# EAGLE design jlink_to_tag (EAGLE 9.6.2)
AUTHOR: Joshua Adkins; REV: E; TITLE: JLink to Tag Connect
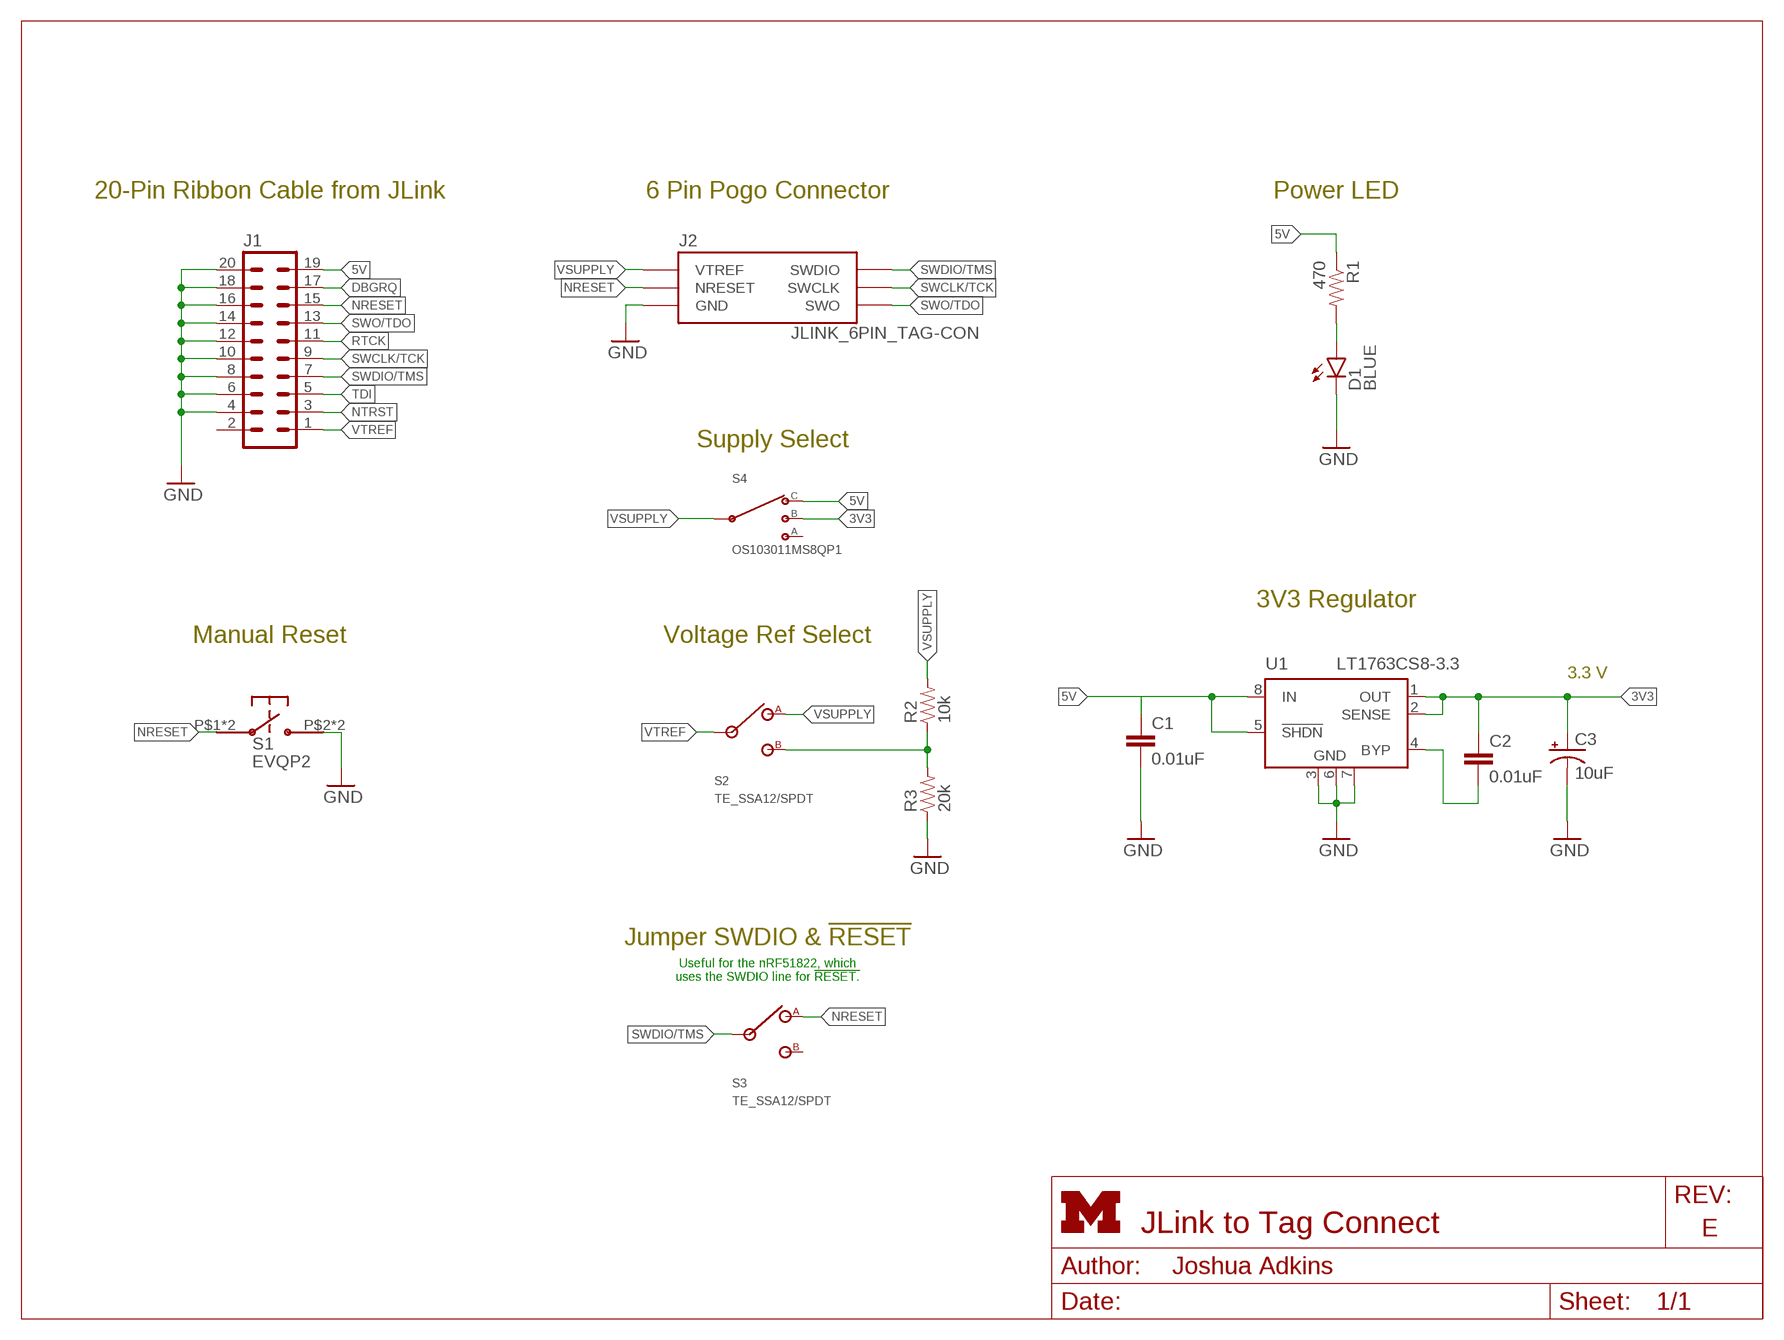
[diagram p0: schematic, sheet 1]
FRAME1 (LETTER_L): HEIGHT: 8.5in; WIDTH: 11in

## Parts
C1  0.01uF  C-EUC0603  [C0603]
C2  0.01uF  C-EUC0603  [C0603]
C3  10uF  CAP_POL1206  [EIA3216]
D1  BLUE  LED-BLUE0603  [LED-0603]
J1  ML20  [ML20]
J2  JLINK_6PIN_TAG-CON  [2X3_MALE_SHROUDED_0.100]
R1  470  RESISTOR0603-RES  [0603-RES]
R2  10k  RESISTOR0603_RES  [0603-RES]
R3  20k  RESISTOR0603_RES  [0603-RES]
S1  EVQP2  [EVQP2]
S2  TE_SSA12/SPDT  [TE_SSA12/SPDT]
S3  TE_SSA12/SPDT  [TE_SSA12/SPDT]
S4  OS103011MS8QP1  [OS102011MS8QP1]
U1  LT1763CS8-3.3  [SOIC8]

## Nets
3V3: C2.1 C3.A(+) S4.3 U1.1(OUT) U1.2(SENSE)
5V: C1.1 J1.19 R1.1 S4.4 U1.5(!SHDN) U1.8(IN)
DBGRQ: J1.17
GND: C1.2 C3.C(-) D1.C J1.4 J1.6 J1.8 J1.10 J1.12 J1.14 J1.16 J1.18 J1.20 J2.5(GND) R3.1 S1.P$2 S1.P$4 U1.3(GND) U1.6(GND) U1.7(GND)
N$1: R2.1 R3.2 S2.2(B)
N$3: D1.A R1.2
N$4: C2.2 U1.4(BYP)
NRESET: J1.15 J2.3(NRESET) S1.P$1 S1.P$3 S3.1(A)
NTRST: J1.3
RTCK: J1.11
SWCLK/TCK: J1.9 J2.4(SWCLK)
SWDIO/TMS: J1.7 J2.2(SWDIO) S3.IN
SWO/TDO: J1.13 J2.6(SWO)
TDI: J1.5
VSUPPLY: J2.1(VTREF) R2.2 S2.1(A) S4.2(C)
VTREF: J1.1 S2.IN
Unconnected: J1.2 S3.2(B) S4.1

## Notes on the sheet
- 20-Pin Ribbon Cable from JLink | 6 Pin Pogo Connector | Power LED
- Supply Select
- 3V3 Regulator
- Manual Reset | Voltage Ref Select
- 3.3 V
- Jumper SWDIO & !RESET
- Useful for the nRF51822, which
  uses the SWDIO line for !RESET.

## Library data of the parts
C1 C2 = resistor:C-EU: CAPACITOR, European symbol; DIGIKEY: 490-1512-1-ND
C3 = SparkFun-Passives:CAP_POL: Capacitor Polarized These are standard SMD and PTH capacitors. Normally 10uF, 47uF, and 100uF in electrolytic and tantalum varieties. Always verify the external diameter of the through hole cap, it varies with capacity, voltage, and manufacturer. The EIA devices should be standard.; DIGIKEY: 399-3684-1-ND
D1 = SparkFun-LED:LED-BLUE: Blue LEDs for production use Various blue LEDs stocked by SparkFun production 0603 - DIO-08575 Rebel - DIO-09553 1206 - DIO-09911; DIGIKEY: 160-1827-1-ND; PROD_ID: DIO-08575
J1 = con-ml:ML20: HARTING; DIGIKEY: S9172-ND; OC_FARNELL: unknown; OC_NEWARK: unknown
J2 = headers:JLINK_6PIN_TAG-CON: This is a 6-pin Tag Connect header with the J-Link.; DIGIKEY: 3M15451-ND
R1 = SparkFun-Passives:RESISTOR: Resistor; DIGIKEY: P470DBCT-ND
R2 = passives:RESISTOR: Resistor; DIGIKEY: RMCF0603FT10K0CT-ND
R3 = passives:RESISTOR: Resistor; DIGIKEY: P20.0KHCT-ND
S1 = switches:EVQP2: SWITCH TACTILE SPST-NO 0.02A 15V; DIGIKEY: P11084SCT-ND
S2 S3 = switches:TE_SSA12/SPDT: SWITCH SLIDE SPDT 2POS SSA SER; DIGIKEY: 2223-SLW-883935-2A-D-ND; MPN: SLW-883935-2A-D
S4 = switches:OS103011MS8QP1: Slide Switch SP3T Through Hole; DIGIKEY: CKN9543-ND
U1 = linear-technology:LT1763CS8: 500mA, Low Noise, LDO Micropower Regulators Source: http://cds.linear.com/docs/Datasheet/1763ff.pdf; DIGIKEY: LT1763CS8-3.3#TRPBFCT-ND; MPN: LT1763CS8-3.3; OC_FARNELL: 1273617; OC_NEWARK: 57M6055

## Board
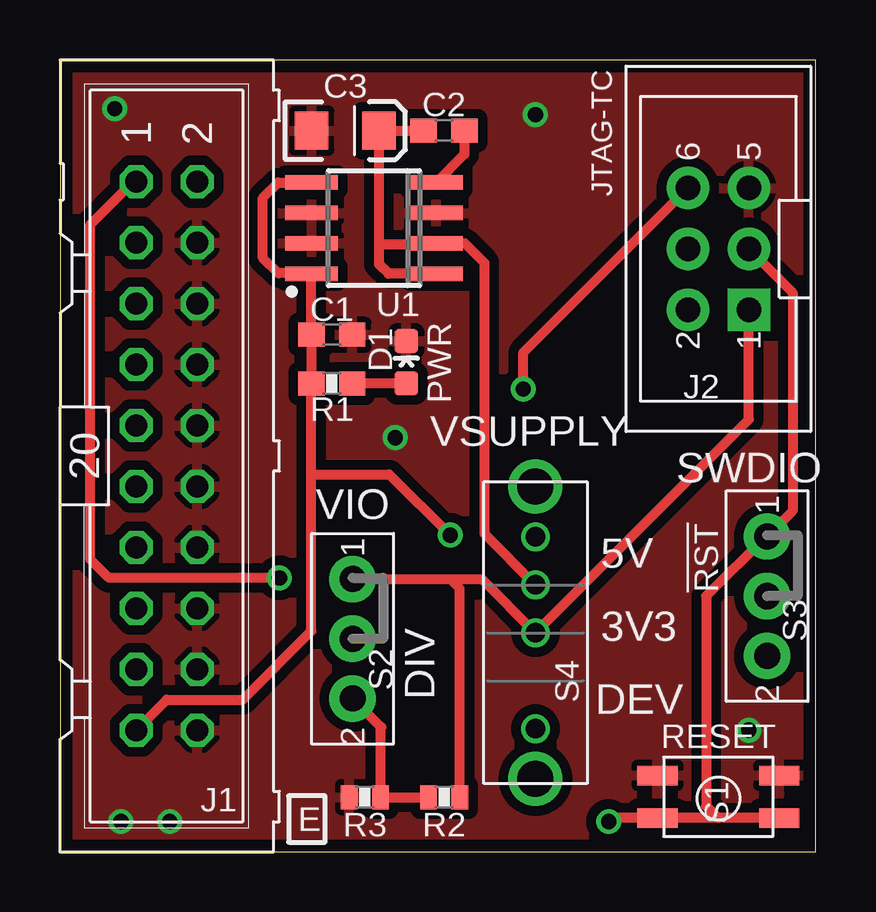
[diagram p1: board, top side]
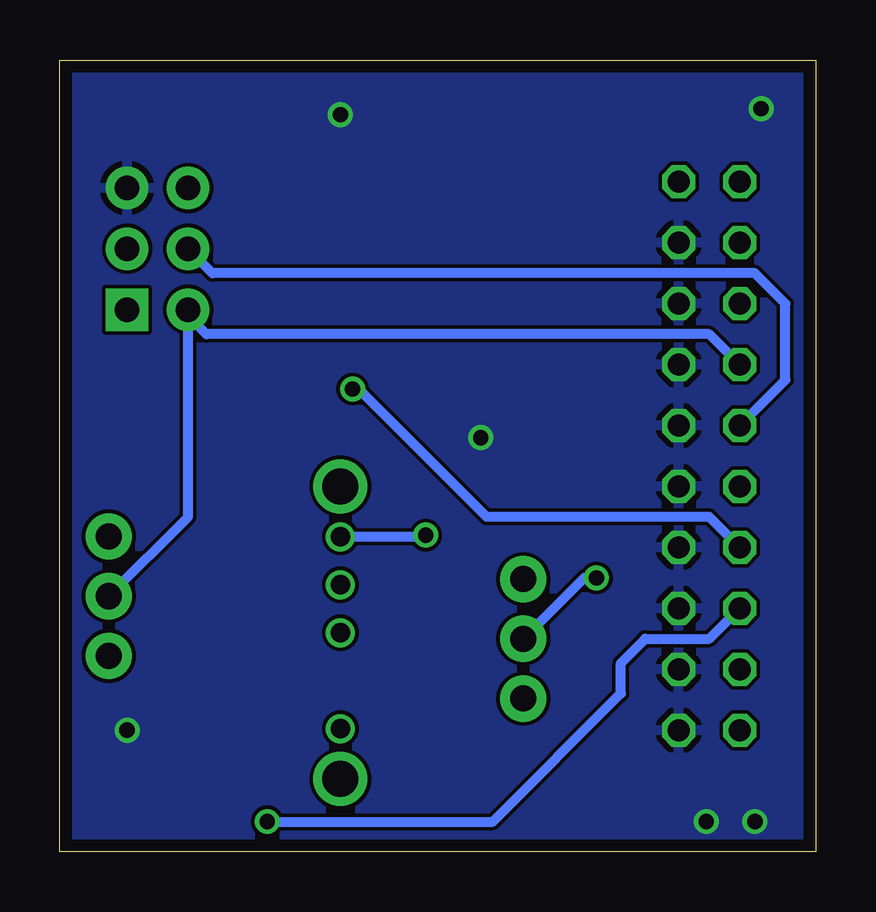
[diagram p2: board, bottom side, seen from below]

Size 31.5 x 33.02 mm. Coordinates in mm from the lower left corner, seen from the top.
Outline: 0,33.02 0,0 31.5,0 31.5,33.02 0,33.02
Copper layers (1*16): Top 0.0178mm / dielectric 59mil / Bottom 0.0178mm
Design rules "sunstone-2lyr_v1.0.0.3 *": minimum track width 6mil, minimum drill 14mil, track to track 6mil, track to pad 6mil, pad to pad 6mil, via to via 6mil, smd to smd 6mil, copper to edge 20mil, drill to drill 16mil, minimum pad ring 8mil, minimum via ring 8mil, stop-mask expansion 3mil, vias tented up to drill 50mil, thermal gap 10mil

### Footprints (pad centres in the part's own frame; a part is rotated, then mirrored left to right if it is on the bottom)
C0603 = smd 1.1 x 1: 1 -0.85,0; 2 0.85,0
EIA3216 = smd 1.4 x 1.6: A 1.4,0; C -1.4,0
LED-0603 = smd 1 x 1: A 0,-0.877; C 0,0.877
ML20 = drill 0.914 octagon: 1 -11.43,-1.27; 2 -11.43,1.27; 3 -8.89,-1.27; 4 -8.89,1.27; 5 -6.35,-1.27; 6 -6.35,1.27; 7 -3.81,-1.27; 8 -3.81,1.27; 9 -1.27,-1.27; 10 -1.27,1.27; 11 1.27,-1.27; 12 1.27,1.27; 13 3.81,-1.27; 14 3.81,1.27; 15 6.35,-1.27; 16 6.35,1.27; 17 8.89,-1.27; 18 8.89,1.27; 19 11.43,-1.27; 20 11.43,1.27
2X3_MALE_SHROUDED_0.100 = drill 1.016 pad 1.778 square: 1 -2.54,-1.27 | drill 1.016 pad 1.778: 2 -2.54,1.27; 3 0,-1.27; 4 0,1.27; 5 2.54,-1.27; 6 2.54,1.27
0603-RES = smd 1.1 x 1: 1 -0.85,0; 2 0.85,0
0603-RES' = smd 0.7 x 1: 1 -0.65,0; 2 0.65,0
EVQP2 = smd 1.676 x 0.813: P$1 -2.54,-0.87; P$2 -2.54,0.908; P$3 2.54,-0.87; P$4 2.54,0.908
TE_SSA12/SPDT = drill 1.092 pad 1.93: 1 -2.489,0; 2 2.489,0; IN 0,0
OS102011MS8QP1 = drill 0.8: 1 -4,0; 2 0,0; 3 2,0; 4 4,0 | drill 1.5: MOUNT1 -6.1,0; MOUNT2 6.1,0
SOIC8 = smd 0.6 x 2.2: 1 -1.905,-2.6; 2 -0.635,-2.6; 3 0.635,-2.6; 4 1.905,-2.6; 5 1.905,2.6; 6 0.635,2.6; 7 -0.635,2.6; 8 -1.905,2.6

### Placement (x,y rotation side)
C1  11.33,21.56 0 top
C2  16,30.07 0 top
C3  11.89,30.07 0 top
D1  14.43,20.42 0 top
J1  4.45,16.51 270 top
J2  27.43,25.15 90 top
R1  11.33,19.53 0 top
R2  10k  [0603-RES']  16,2.29 0 top
R3  20k  [0603-RES']  12.7,2.29 0 top
S1  27.43,2.29 0 top
S2  12.19,8.89 270 top
S3  29.46,10.67 270 top
S4  19.81,9.14 90 top
U1  13.08,26.01 90 top

### Tracks (layer width: path | path; a pad name or v marks a point on that pad's centre or on a via)
3V3
  Top 0.406: U1.1 13.69,24.11 13.29,24.51 13.29,25.4 | C2.1 C3.A 13.29,25.4 | 13.29,25.4 13.36,25.32 15.66,25.32 U1.2 16.87,25.38 17.68,24.56 17.68,13.28 S4.3
5V  (via drill 0.64)
  Top 0.406: 10.48,24.13 C1.1 R1.1 10.48,15.75 | 10.48,24.13 U1.8 | J1.19 4.45,6.35 7.62,6.35 10.48,9.21 10.48,15.75 | 10.48,24.13 9.1,24.13 8.46,24.77 8.46,27.28 9.09,27.91 U1.5 | 10.48,15.75 13.72,15.75 v16.26,13.21
  Bottom 0.406: v16.26,13.21 16.32,13.14 S4.4
GND  (via drill 0.64)
  other vias: 2.54,1.27 4.57,1.27 19.81,30.73 2.29,30.99 13.97,17.27 28.7,5.08
  pour Top (isolate 0.406): -1.27,-1.27 33.02,-1.27 33.02,34.29 -1.27,34.29
  pour Bottom: -1.27,34.29 33.02,34.29 33.02,-1.27 -1.27,-1.27
N$1
  Top 0.406: S2.2 13.39,5.21 13.35,5.2 R3.2 R2.1
N$3
  Top 0.406: R1.2 12.19,19.55 D1.A
N$4
  Top 0.406: C2.2 16.85,29.09 U1.4
NRESET  (via drill 0.64)
  Top 0.406: J2.3 30.53,23.32 30.53,14.22 S3.1 29.44,13.18 26.92,10.67 26.92,1.92 27.43,1.42 | S1.P$3 27.43,1.42 | 27.43,1.42 S1.P$1 23.01,1.42 v22.86,1.27
  Bottom 0.406: v22.86,1.27 13.46,1.27 8.13,6.6 8.13,7.87 7.11,8.89 4.45,8.89 J1.15
SWCLK/TCK
  Bottom 0.406: J1.9 1.27,19.68 1.27,22.86 2.54,24.13 25.15,24.13 J2.4
SWDIO/TMS
  Bottom 0.406: J1.7 4.45,21.59 25.4,21.59 26.16,22.35 J2.2 26.16,13.97 S3.IN
SWO/TDO  (via drill 0.64)
  Top 0.406: v19.3,19.3 19.3,20.83 J2.6
  Bottom 0.406: J1.13 4.45,13.97 13.72,13.97 19.05,19.3 v19.3,19.3
VSUPPLY
  Top 0.406: J2.1 28.7,18.03 S4.2 17.58,11.38 16.26,11.38 | S2.1 16.26,11.38 | R2.2 16.65,10.98 16.26,11.38
VTREF  (via drill 0.64)
  Top 0.406: v9.14,11.43 2.03,11.43 1.27,12.19 1.27,26.16 3.05,27.94 J1.1
  Bottom 0.406: S2.IN 9.65,11.43 v9.14,11.43

### Text on the board
tPlace: JTAG-TC | PWR | VSUPPLY | SWDIO | VIO | !RST | 5V | 3V3 | DIV | DEV | RESET | E